# EAGLE design wetPOT (EAGLE 7.2.0)
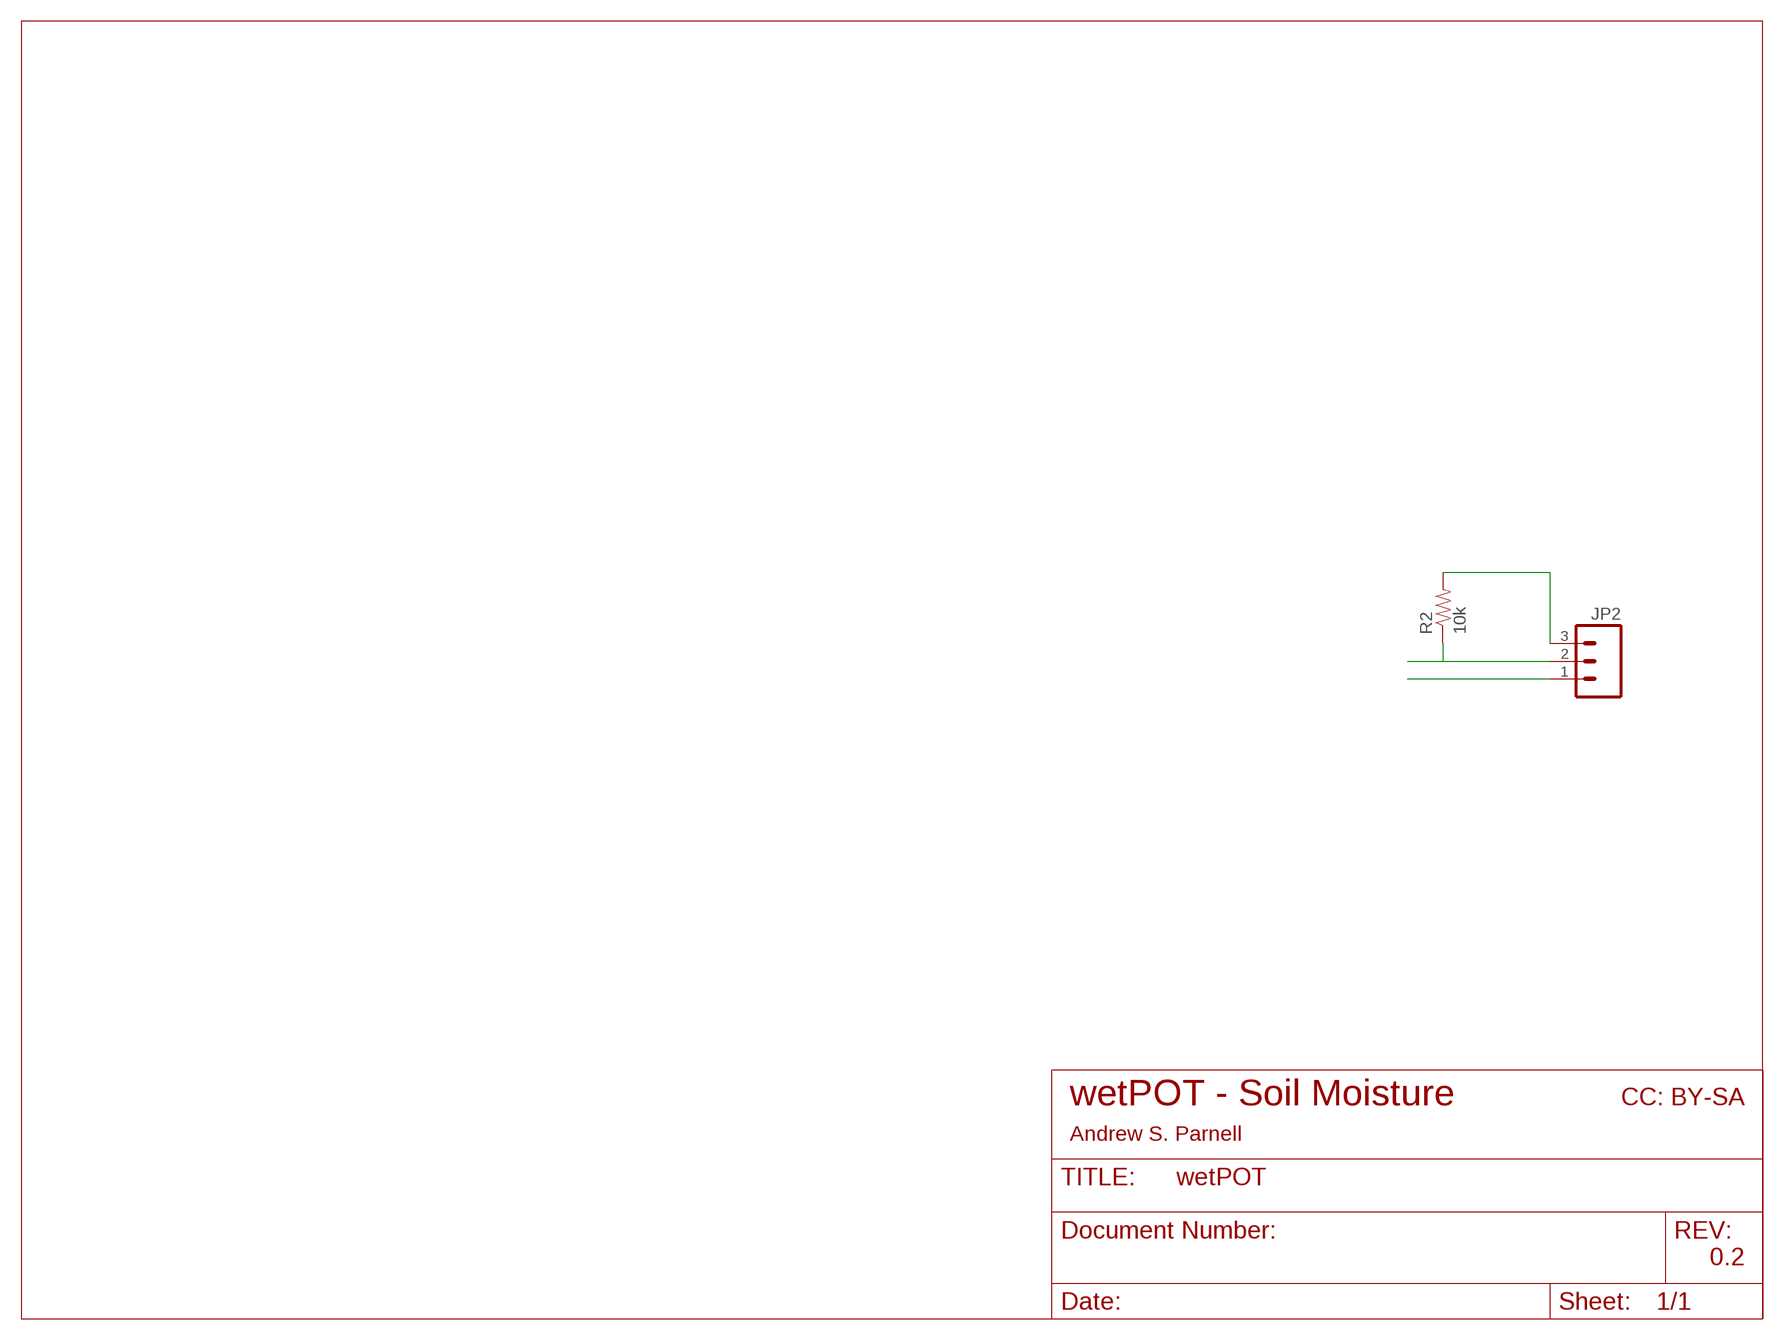
[diagram p0: schematic, sheet 1]

## Parts
JP2  M03PTH  [1X03]
R2  10k  10KOHM-1/4W-1%(PTH)HORIZ  [AXIAL-0.3]

## Nets
PIN0: JP2.3 R2.P$2
PIN1: JP2.2 R2.P$1
PIN2: JP2.1

## Notes on the sheet
- wetPOT - Soil Moisture | CC: BY-SA
- Andrew S. Parnell
- 0.2

## Library data of the parts
JP2 = SparkFun-Connectors:M03: Header 3 Standard 3-pin 0.1" header. Use with straight break away headers (SKU : PRT-00116), right angle break away headers (PRT-00553), swiss pins (PRT-00743), machine pins (PRT-00117), and female headers (PRT-00115). Molex polarized connector foot print use with SKU : PRT-08232 with associated crimp pins and housings.
R2 = SparkFun-Resistors:10KOHM-1/4W-1%(PTH): RES-12183; PROD_ID: RES-12183

## Board
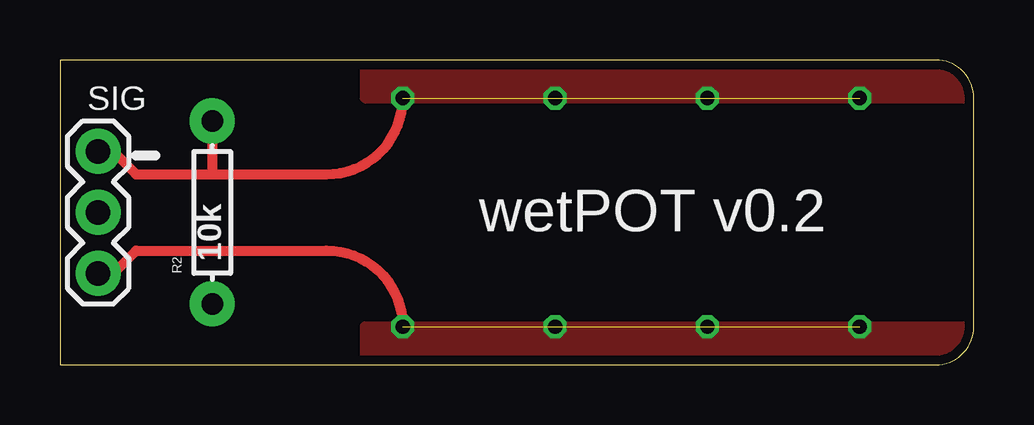
[diagram p1: board, top side]
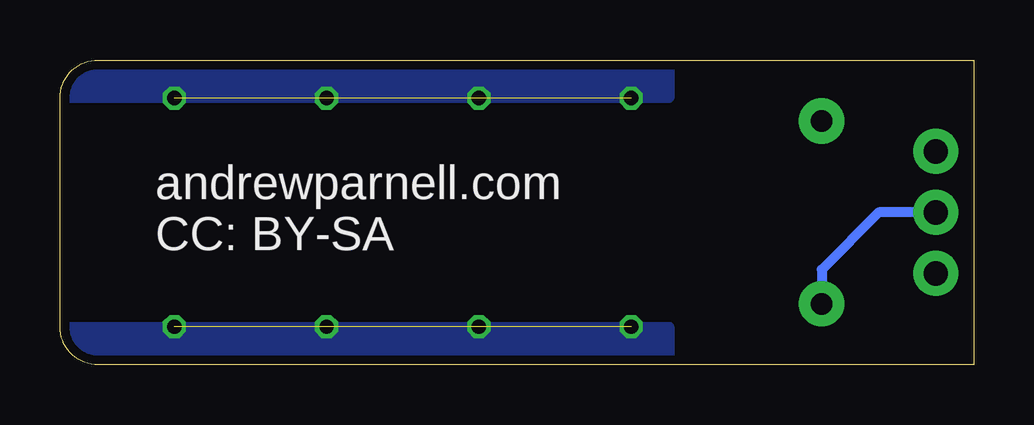
[diagram p2: board, bottom side, seen from below]

Size 38.1 x 12.7 mm. Coordinates in mm from the lower left corner, seen from the top.
Outline: 0,0 36.51,0 arc90 38.1,1.59 38.1,11.11 arc90 36.51,12.7 0,12.7 0,0
Copper layers (1*16): Top 0.0356mm / dielectric 1.5011mm / Bottom 0.0356mm
Design rules "LaenPCBOrder": minimum track width 6mil, minimum drill 13mil, track to track 6mil, track to pad 6mil, pad to pad 6mil, via to via 6mil, smd to smd 6mil, copper to edge 15mil, drill to drill 6mil, minimum pad ring 7mil, minimum via ring 7mil, stop-mask expansion 3mil, vias tented up to drill 0mil, thermal gap 10mil

### Footprints (pad centres in the part's own frame; a part is rotated, then mirrored left to right if it is on the bottom)
1X03 = drill 1.016 pad 1.88: 1 0,0; 2 2.54,0; 3 5.08,0
AXIAL-0.3 = drill 0.9 pad 1.88: P$1 -3.81,0; P$2 3.81,0

### Placement (x,y rotation side)
JP2  1.59,3.81 90 top
R2  6.35,6.35 90 top

### Tracks (layer width: path | path; a pad name or v marks a point on that pad's centre or on a via)
PIN0  (via drill 0.6)  (3 unrouted)
  Top 0.406: 6.35,7.94 3.17,7.94 2.38,8.73 1.75,8.73 JP2.3 | 6.35,7.94 11.11,7.94 arc90 v14.29,11.11 | R2.P$2 6.35,7.94
  other vias: 20.64,11.11 26.99,11.11 33.34,11.11
  pour Top: 12.7,12.7 12.7,11.11 38.1,11.11 arc90 36.51,12.7
  pour Bottom: 12.7,12.7 12.7,11.11 38.1,11.11 arc90 36.51,12.7
PIN1
  Bottom 0.406: JP2.2 3.97,6.35 6.35,3.97 R2.P$1
PIN2  (via drill 0.6)  (3 unrouted)
  Top 0.406: v14.29,1.59 arc90 11.11,4.76 3.17,4.76 2.38,3.97 1.75,3.97 JP2.1
  other vias: 20.64,1.59 26.99,1.59 33.34,1.59
  pour Bottom: 12.7,1.59 12.7,0 35.72,0 36.51,0 arc90 38.1,1.59
  pour Top: 12.7,1.59 12.7,0 36.51,0 arc90 38.1,1.59

### Text on the board
_tsilk: SIG | wetPOT v0.2
_bsilk: andrewparnell.com / CC: BY-SA